# Altium project F103ZET6.PrjPCB
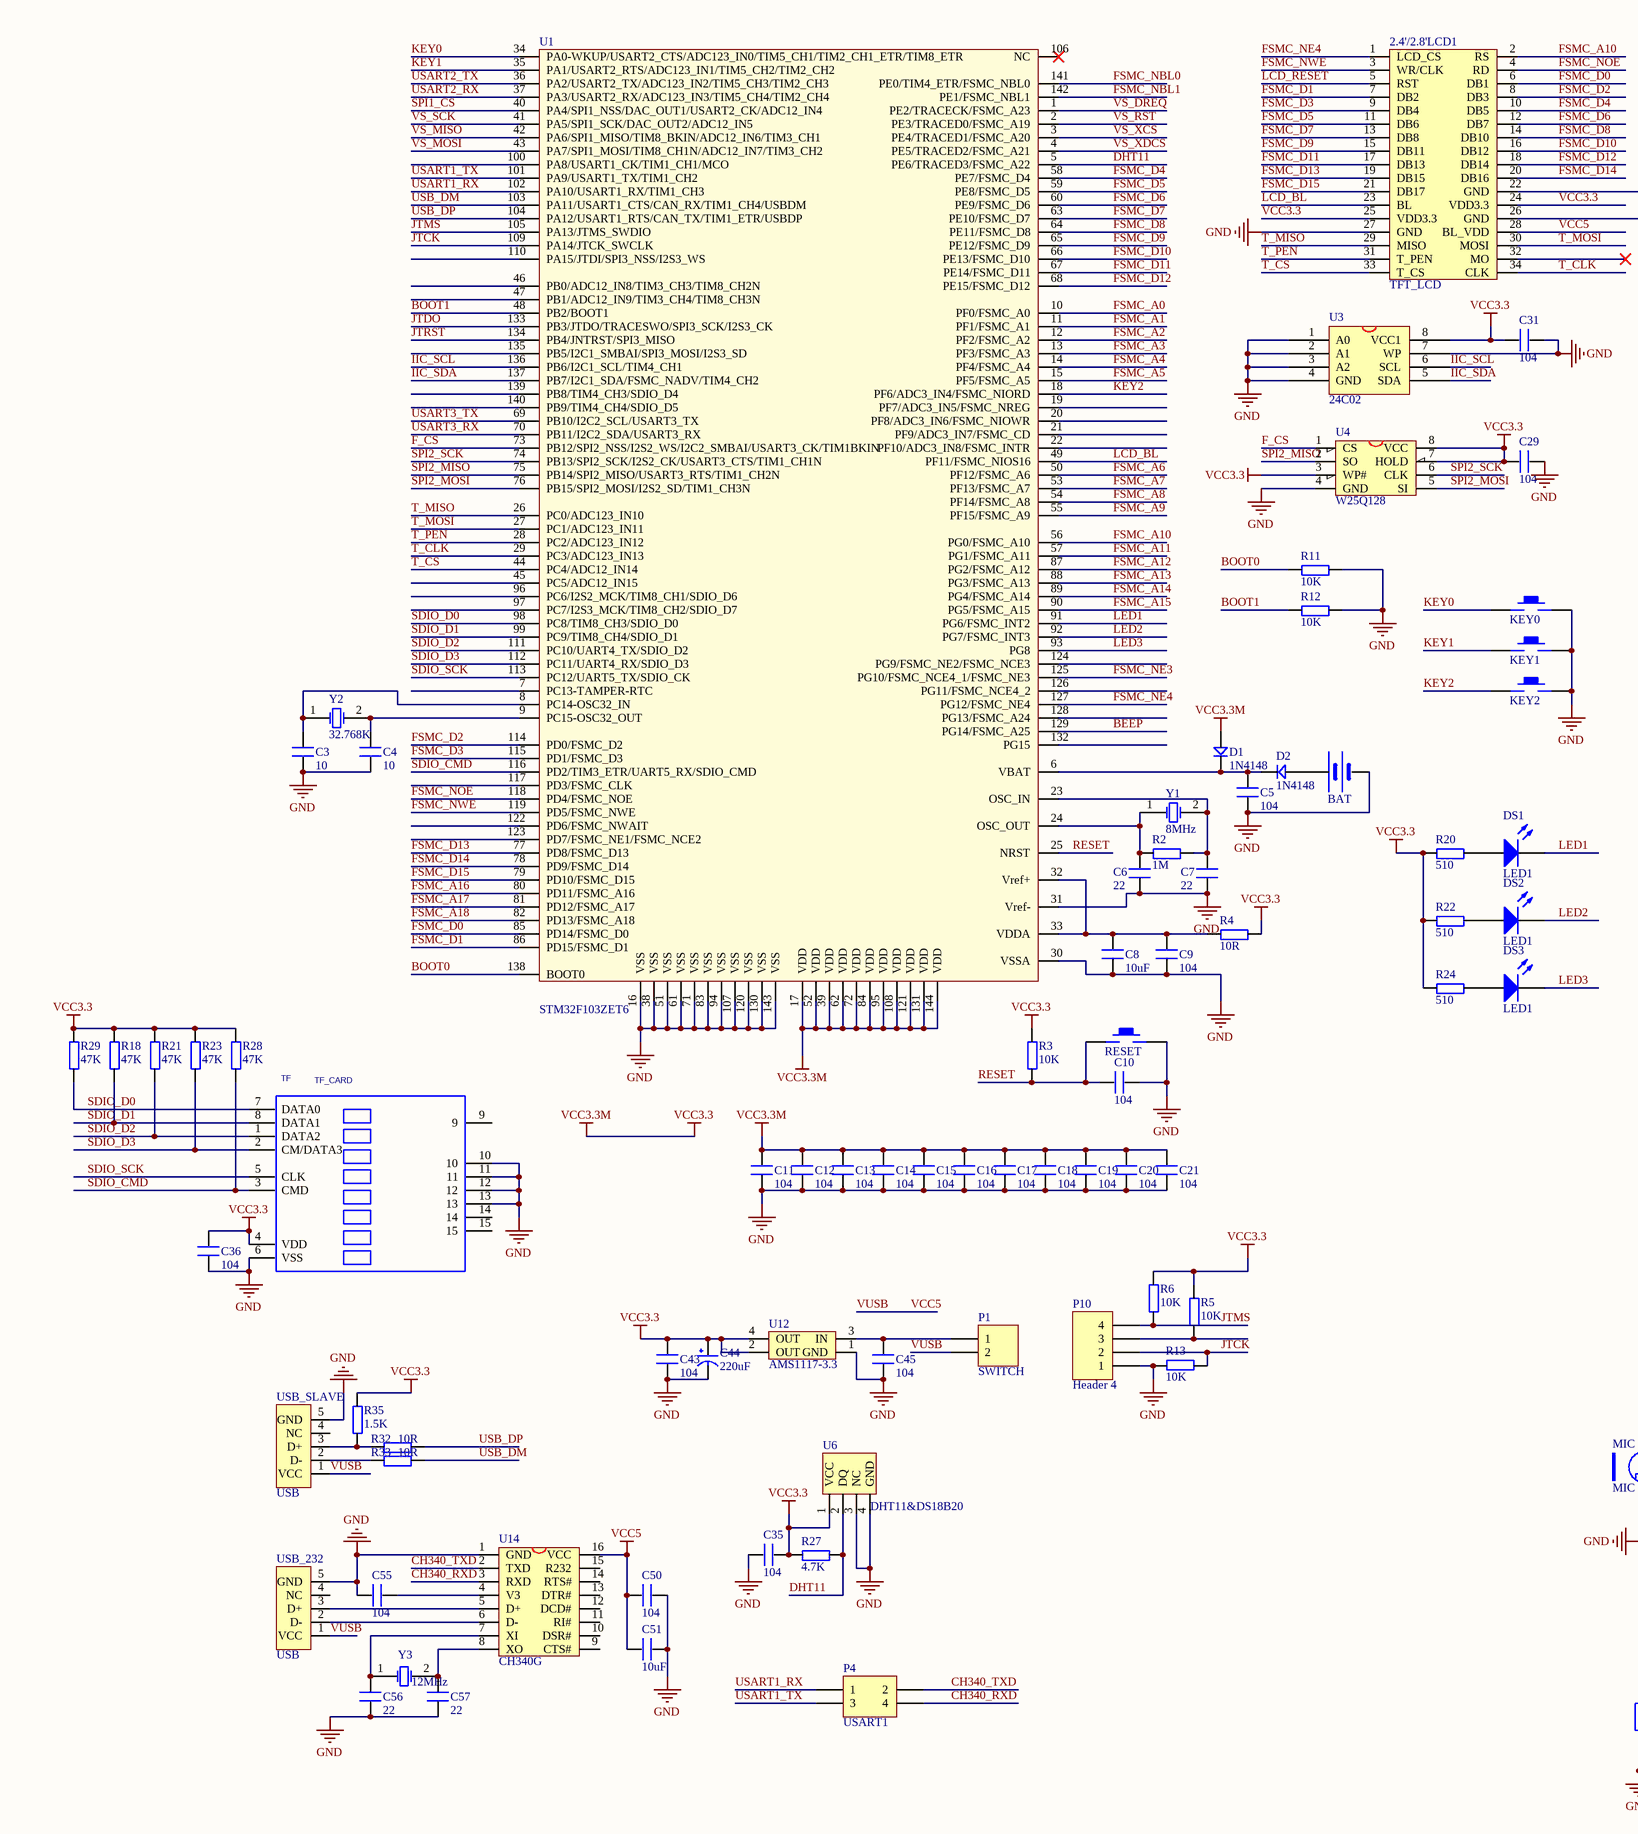
[diagram p0: F103ZET6.SchDoc, left]
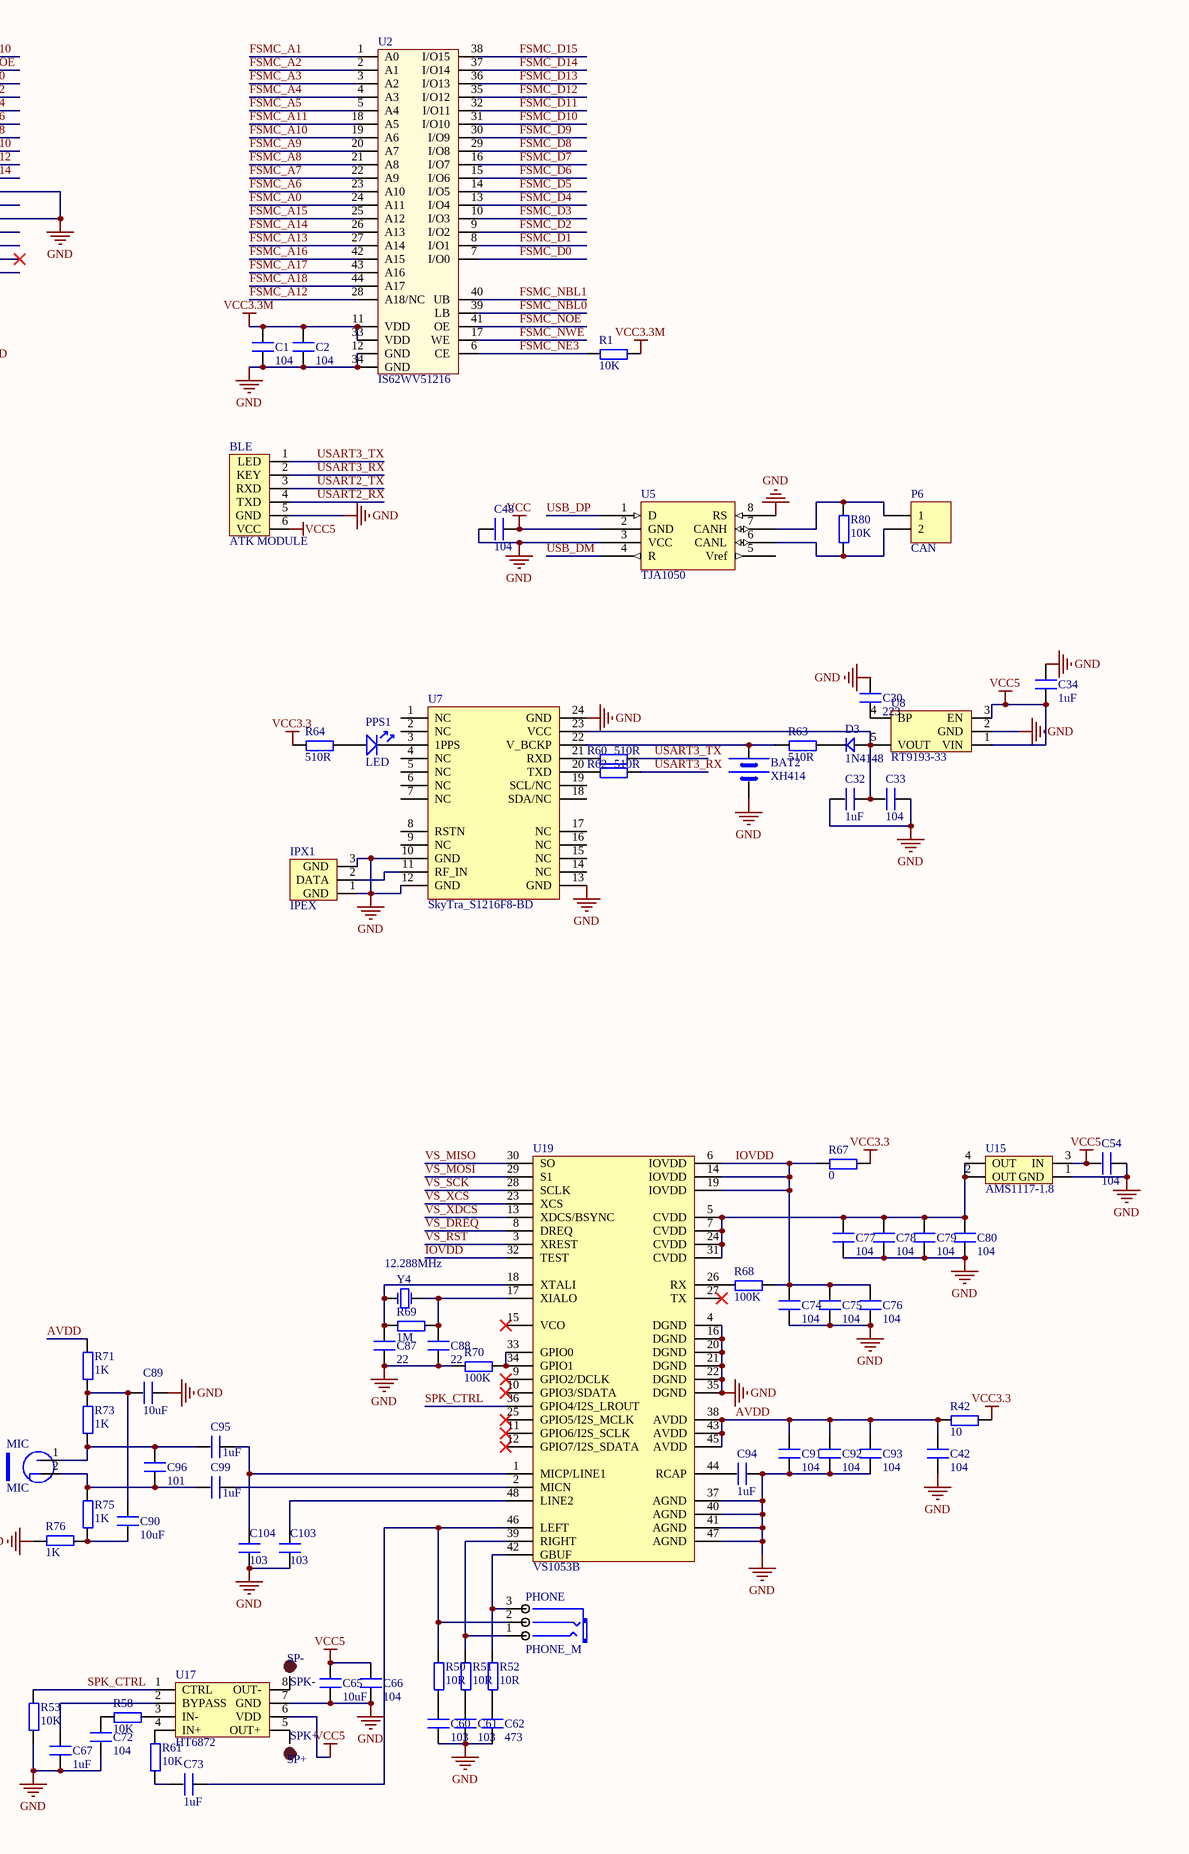
[diagram p1: F103ZET6.SchDoc, right]
1 sheet, 153 parts. Net scope: global (net labels, ports and power ports of the same name join across sheets).
Board file: F103ZET6.PcbDoc

## Sheet F103ZET6.SchDoc
size A2

### Parts
2.4'/2.8'LCD1  TFT_LCD  [db2*17-4.3]
BAT  BATT  [CR1220_A]  (value not drawn)
BAT2  XH414  [XH414]
BLE  ATK MODULE  [HEAD6]
C1  104  [C 0603_M]
C2  104  [C 0603_M]
C3  10  [C 0603_M]
C4  10  [C 0603_M]
C5  104  [C 0603_M]
C6  22  [C 0603_M]
C7  22  [C 0603_M]
C8  10uF  [C 0805_M]
C9  104  [C 0603_M]
C10  104  [C 0603_M]
C11  104  [C 0603_M]
C12  104  [C 0603_M]
C13  104  [C 0603_M]
C14  104  [C 0603_M]
C15  104  [C 0603_M]
C16  104  [C 0603_M]
C17  104  [C 0603_M]
C18  104  [C 0603_M]
C19  104  [C 0603_M]
C20  104  [C 0603_M]
C21  104  [C 0603_M]
C29  104  [C 0603_M]
C30  223  [0603P]
C31  104  [C 0603_M]
C32  1uF  [0603P]
C33  104  [0603P]
C34  1uF  [0603P]
C35  104  [C 0603_M]
C36  104  [C 0603_M]
C42  104  [C 0603_M]
C43  104  [C 0603_M]
C44  220uF  [CT 6*6 - C]
C45  104  [C 0603_M]
C48  104  [0603P]
C50  104  [C 0603_M]
C51  10uF  [C 0805_M]
C54  104  [C 0603_M]
C55  104  [C 0603_M]
C56  22  [C 0603_M]
C57  22  [C 0603_M]
C60  103  [C 0603_M]
C61  103  [C 0603_M]
C62  473  [C 0603_M]
C65  10uF  [C 0805_M]
C66  104  [C 0603_M]
C67  1uF  [C 0603_M]
C72  104  [C 0603_M]
C73  1uF  [C 0603_M]
C74  104  [C 0603_M]
C75  104  [C 0603_M]
C76  104  [C 0603_M]
C77  104  [C 0603_M]
C78  104  [C 0603_M]
C79  104  [C 0603_M]
C80  104  [C 0603_M]
C87  22  [C 0603_M]
C88  22  [C 0603_M]
C89  10uF  [C 0805_M]
C90  10uF  [C 0805_M]
C91  104  [C 0603_M]
C92  104  [C 0603_M]
C93  104  [C 0603_M]
C94  1uF  [C 0603_M]
C95  1uF  [C 0603_M]
C96  101  [C 0603_M]
C99  1uF  [C 0603_M]
C103  103  [C 0603_M]
C104  103  [C 0603_M]
D1  1N4148  [DIODE_SOP]
D2  1N4148  [DIODE_SOP]
D3  1N4148  [DIODE_SOP]
DS1  LED1  [LED 0603R]
DS2  LED1  [LED 0603R]
DS3  LED1  [LED 0603R]
IPX1  IPEX  [IPEX]
KEY0  KEY_M  [TSW SMD-3*6*2.5]  (value not drawn)
KEY1  KEY_M  [TSW SMD-3*6*2.5]  (value not drawn)
KEY2  KEY_M  [TSW SMD-3*6*2.5]  (value not drawn)
MIC  MIC  [MIC]
P1  SWITCH  [HDR2.54-LI-2P]
P4  USART1  [HDR2.54-LI-2x2P]
P6  CAN  [HDR1X2]
P10  Header 4  [HDR2.54-LI-4P]
PHONE  PHONE_M  [PHONE_ST]
PPS1  LED  [SMDLED]
R1  10K  [R 0603_M]
R2  1M  [R 0603_M]
R3  10K  [R 0603_M]
R4  10R  [R 0603_M]
R5  10K  [R 0603_M]
R6  10K  [R 0603_M]
R11  10K  [R 0603_M]
R12  10K  [R 0603_M]
R13  10K  [R 0603_M]
R18  47K  [R 0603_M]
R20  510  [0603P]
R21  47K  [R 0603_M]
R22  510  [0603P]
R23  47K  [R 0603_M]
R24  510  [0603P]
R27  4.7K  [R 0603_M]
R28  47K  [R 0603_M]
R29  47K  [R 0603_M]
R32  10R  [R 0603_M]
R33  10R  [R 0603_M]
R35  1.5K  [R 0603_M]
R42  10  [R 0603_M]
R50  10R  [R 0603_M]
R51  10R  [R 0603_M]
R52  10R  [R 0603_M]
R53  10K  [R 0603_M]
R58  10K  [R 0603_M]
R60  510R  [0603P]
R61  10K  [R 0603_M]
R62  510R  [0603P]
R63  510R  [0603P]
R64  510R  [0603P]
R67  0  [R 0603_M]
R68  100K  [R 0603_M]
R69  1M  [R 0603_M]
R70  100K  [R 0603_M]
R71  1K  [R 0603_M]
R73  1K  [R 0603_M]
R75  1K  [R 0603_M]
R76  1K  [R 0603_M]
R80  10K  [0603P]
RESET  KEY_M  [TSW SMD-3*6*2.5]  (value not drawn)
SP+  SPK+  [TP-1.5]
SP-  SPK-  [TP-1.5]
TF  TF_CARD  [TF_CARD]
U1  STM32F103ZET6  [LQFP144]
U2  IS62WV51216  [TSOP44]
U3  24C02  [SOP-8]
U4  W25Q128  [SOIC-8]
U5  TJA1050  [SOP-8]
U6  DHT11&DS18B20  [DHT11]
U7  SkyTra_S1216F8-BD  [GPS_NEO-6]
U8  RT9193-33  [SOT-23-5]
U12  AMS1117-3.3  [AMS1117]
U14  CH340G  [SOP16M]
U15  AMS1117-1.8  [AMS1117]
U17  HT6872  [SOP-8]
U19  VS1053B  [mTQFP48]
USB_232  USB  [USB-MINI-A]
USB_SLAVE  USB  [USB-MINI-A]
Y1  8MHz  [OSC HC-49S]
Y2  32.768K  [OSC-2x6-WI-A]
Y3  12MHz  [OSC HC-49S]
Y4  12.288MHz  [OSC HC-49S]

### Nets
GND: 2.4'/2.8'LCD1.22(GND) 2.4'/2.8'LCD1.26(GND) 2.4'/2.8'LCD1.27(GND) BAT.2(GND) BAT2.2(GND) BLE.5(GND) C1.1 C2.1 C3.1 C4.2 C5.1 C6.1 C7.1 C8.1 C9.1 C10.1 C11.1 C12.1 C13.1 C14.1 C15.1 C16.1 C17.1 C18.1 C19.1 C20.1 C21.1 C29.2 C30.2 C31.2 C32.1 C33.2 C34.2 C35.1 C36.1 C42.1 C43.1 C44.2(GND) C45.1 C48.1 C50.2 C51.2 C54.2 C55.1 C56.1 C57.2 C60.1 C61.1 C62.1 C65.1 C66.1 C67.1 C72.1 C74.1 C75.1 C76.1 C77.2 C78.2 C79.2 C80.1 C87.1 C88.1 C89.1 C91.1 C92.1 C93.1 C94.2 C103.1 C104.1 IPX1.1(GND) IPX1.3(GND) KEY0.2 KEY1.2 KEY2.2 P10.1 R11.2 R12.2 R13.2 R53.1 R70.1 R76.2 RESET.2 TF.6(VSS) TF.10 TF.11 TF.12 TF.13 U1.16(VSS) U1.30(VSSA) U1.31(Vref-) U1.38(VSS) U1.51(VSS) U1.61(VSS) U1.71(VSS) U1.83(VSS) U1.94(VSS) U1.107(VSS) U1.120(VSS) U1.130(VSS) U1.143(VSS) U2.12(GND) U2.34(GND) U3.1(A0) U3.2(A1) U3.3(A2) U3.4(GND) U3.7(WP) U4.4(GND) U5.3(VCC) U5.8(RS) U6.3(NC) U6.4(GND) U7.10(GND) U7.12(GND) U7.13(GND) U7.24(GND) U8.2(GND) U12.1(GND) U14.1(GND) U15.1(GND) U17.7(GND) U19.4(DGND) U19.16(DGND) U19.20(DGND) U19.21(DGND) U19.22(DGND) U19.35(DGND) U19.37(AGND) U19.40(AGND) U19.41(AGND) U19.47(AGND) USB_232.5(GND) USB_SLAVE.5(GND)
VCC: C48.2 U5.2(GND)
VCC3.3: 2.4'/2.8'LCD1.24(VDD3.3) 2.4'/2.8'LCD1.25(VDD3.3) C1.2 C2.2 C11.2 C12.2 C13.2 C14.2 C15.2 C16.2 C17.2 C18.2 C19.2 C20.2 C21.2 C29.1 C31.1 C35.2 C36.2 C43.2 C44.1(VCC) D1.1 R1.2 R3.2 R4.2 R5.2 R6.2 R18.2 R20.1 R21.2 R22.1 R23.2 R24.1 R27.1 R28.2 R29.2 R35.2 R42.2 R64.1 R67.2 TF.4(VDD) U1.17(VDD) U1.39(VDD) U1.52(VDD) U1.62(VDD) U1.72(VDD) U1.84(VDD) U1.95(VDD) U1.108(VDD) U1.121(VDD) U1.131(VDD) U1.144(VDD) U2.11(VDD) U2.33(VDD) U3.8(VCC1) U4.3(WP#) U4.7(HOLD) U4.8(VCC) U6.1(VCC) U12.2(OUT) U12.4(OUT)  [also labelled VCC3.3M]
VCC5: 2.4'/2.8'LCD1.28(BL_VDD) BLE.6(VCC) C34.1 C50.1 C51.1 C54.1 C65.2 C66.2 P1.2 U8.1(VIN) U8.3(EN) U14.16(VCC) U15.3(IN) U17.6(VDD) USB_232.1(VCC) USB_SLAVE.1(VCC)  [also labelled VUSB]
AVDD: C42.2 C91.2 C92.2 C93.2 R42.1 R71.2 U19.38(AVDD) U19.43(AVDD) U19.45(AVDD)
BEEP: U1.129(PG14/FSMC_A25)
BOOT0: R11.1 U1.138(BOOT0)
BOOT1: R12.1 U1.48(PB2/BOOT1)
CH340_RXD: P4.4 U14.3(RXD)
CH340_TXD: P4.2 U14.2(TXD)
DHT11: R27.2 U1.5(PE6/TRACED3/FSMC_A22) U6.2(DQ)
F_CS: U1.73(PB12/SPI2_NSS/I2S2_WS/I2C2_SMBAI/USART3_CK/TIM1BKIN) U4.1(CS)
FSMC_A0: U1.10(PF0/FSMC_A0) U2.24(A11)
FSMC_A1: U1.11(PF1/FSMC_A1) U2.1(A0)
FSMC_A2: U1.12(PF2/FSMC_A2) U2.2(A1)
FSMC_A3: U1.13(PF3/FSMC_A3) U2.3(A2)
FSMC_A4: U1.14(PF4/FSMC_A4) U2.4(A3)
FSMC_A5: U1.15(PF5/FSMC_A5) U2.5(A4)
FSMC_A6: U1.50(PF12/FSMC_A6) U2.23(A10)
FSMC_A7: U1.53(PF13/FSMC_A7) U2.22(A9)
FSMC_A8: U1.54(PF14/FSMC_A8) U2.21(A8)
FSMC_A9: U1.55(PF15/FSMC_A9) U2.20(A7)
FSMC_A10: 2.4'/2.8'LCD1.2(RS) U1.56(PG0/FSMC_A10) U2.19(A6)
FSMC_A11: U1.57(PG1/FSMC_A11) U2.18(A5)
FSMC_A12: U1.87(PG2/FSMC_A12) U2.28(A18/NC)
FSMC_A13: U1.88(PG3/FSMC_A13) U2.27(A14)
FSMC_A14: U1.89(PG4/FSMC_A14) U2.26(A13)
FSMC_A15: U1.90(PG5/FSMC_A15) U2.25(A12)
FSMC_A16: U1.80(PD11/FSMC_A16) U2.42(A15)
FSMC_A17: U1.81(PD12/FSMC_A17) U2.43(A16)
FSMC_A18: U1.82(PD13/FSMC_A18) U2.44(A17)
FSMC_D0: 2.4'/2.8'LCD1.6(DB1) U1.85(PD14/FSMC_D0) U2.7(I/O0)
FSMC_D1: 2.4'/2.8'LCD1.7(DB2) U1.86(PD15/FSMC_D1) U2.8(I/O1)
FSMC_D2: 2.4'/2.8'LCD1.8(DB3) U1.114(PD0/FSMC_D2) U2.9(I/O2)
FSMC_D3: 2.4'/2.8'LCD1.9(DB4) U1.115(PD1/FSMC_D3) U2.10(I/O3)
FSMC_D4: 2.4'/2.8'LCD1.10(DB5) U1.58(PE7/FSMC_D4) U2.13(I/O4)
FSMC_D5: 2.4'/2.8'LCD1.11(DB6) U1.59(PE8/FSMC_D5) U2.14(I/O5)
FSMC_D6: 2.4'/2.8'LCD1.12(DB7) U1.60(PE9/FSMC_D6) U2.15(I/O6)
FSMC_D7: 2.4'/2.8'LCD1.13(DB8) U1.63(PE10/FSMC_D7) U2.16(I/O7)
FSMC_D8: 2.4'/2.8'LCD1.14(DB10) U1.64(PE11/FSMC_D8) U2.29(I/O8)
FSMC_D9: 2.4'/2.8'LCD1.15(DB11) U1.65(PE12/FSMC_D9) U2.30(I/O9)
FSMC_D10: 2.4'/2.8'LCD1.16(DB12) U1.66(PE13/FSMC_D10) U2.31(I/O10)
FSMC_D11: 2.4'/2.8'LCD1.17(DB13) U1.67(PE14/FSMC_D11) U2.32(I/O11)
FSMC_D12: 2.4'/2.8'LCD1.18(DB14) U1.68(PE15/FSMC_D12) U2.35(I/O12)
FSMC_D13: 2.4'/2.8'LCD1.19(DB15) U1.77(PD8/FSMC_D13) U2.36(I/O13)
FSMC_D14: 2.4'/2.8'LCD1.20(DB16) U1.78(PD9/FSMC_D14) U2.37(I/O14)
FSMC_D15: 2.4'/2.8'LCD1.21(DB17) U1.79(PD10/FSMC_D15) U2.38(I/O15)
FSMC_NBL0: U1.141(PE0/TIM4_ETR/FSMC_NBL0) U2.39(LB)
FSMC_NBL1: U1.142(PE1/FSMC_NBL1) U2.40(UB)
FSMC_NE3: R1.1 U1.125(PG10/FSMC_NCE4_1/FSMC_NE3) U2.6(CE)
FSMC_NE4: 2.4'/2.8'LCD1.1(LCD_CS) U1.127(PG12/FSMC_NE4)
FSMC_NOE: 2.4'/2.8'LCD1.4(RD) U1.118(PD4/FSMC_NOE) U2.41(OE)
FSMC_NWE: 2.4'/2.8'LCD1.3(WR/CLK) U1.119(PD5/FSMC_NWE) U2.17(WE)
IIC_SCL: U1.136(PB6/I2C1_SCL/TIM4_CH1) U3.6(SCL)
IIC_SDA: U1.137(PB7/I2C1_SDA/FSMC_NADV/TIM4_CH2) U3.5(SDA)
IOVDD: C74.2 C75.2 C76.2 R67.1 R68.2 U19.6(IOVDD) U19.14(IOVDD) U19.19(IOVDD) U19.32(TEST)
JTCK: P10.2 R13.1 U1.109(PA14/JTCK_SWCLK)
JTDO: U1.133(PB3/JTDO/TRACESWO/SPI3_SCK/I2S3_CK)
JTMS: P10.4 R6.1 U1.105(PA13/JTMS_SWDIO)
JTRST: U1.134(PB4/JNTRST/SPI3_MISO)
KEY0: KEY0.1 U1.34(PA0-WKUP/USART2_CTS/ADC123_IN0/TIM5_CH1/TIM2_CH1_ETR/TIM8_ETR)
KEY1: KEY1.1 U1.35(PA1/USART2_RTS/ADC123_IN1/TIM5_CH2/TIM2_CH2)
KEY2: KEY2.1 U1.18(PF6/ADC3_IN4/FSMC_NIORD)
LCD_BL: 2.4'/2.8'LCD1.23(BL) U1.49(PF11/FSMC_NIOS16)
LCD_RESET: 2.4'/2.8'LCD1.5(RST)
LED1: DS1.2(K) U1.91(PG6/FSMC_INT2)
LED2: DS2.2(K) U1.92(PG7/FSMC_INT3)
LED3: DS3.2(K) U1.93(PG8)
RESET: C10.2 R3.1 RESET.1 U1.25(NRST)
SDIO_CMD: R28.1 TF.3(CMD) U1.116(PD2/TIM3_ETR/UART5_RX/SDIO_CMD)
SDIO_D0: R29.1 TF.7(DATA0) U1.98(PC8/TIM8_CH3/SDIO_D0)
SDIO_D1: R18.1 TF.8(DATA1) U1.99(PC9/TIM8_CH4/SDIO_D1)
SDIO_D2: R21.1 TF.1(DATA2) U1.111(PC10/UART4_TX/SDIO_D2)
SDIO_D3: R23.1 TF.2(CM/DATA3) U1.112(PC11/UART4_RX/SDIO_D3)
SDIO_SCK: TF.5(CLK) U1.113(PC12/UART5_TX/SDIO_CK)
SPI1_CS: U1.40(PA4/SPI1_NSS/DAC_OUT1/USART2_CK/ADC12_IN4)
SPI2_MISO: U1.75(PB14/SPI2_MISO/USART3_RTS/TIM1_CH2N) U4.2(SO)
SPI2_MOSI: U1.76(PB15/SPI2_MOSI/I2S2_SD/TIM1_CH3N) U4.5(SI)
SPI2_SCK: U1.74(PB13/SPI2_SCK/I2S2_CK/USART3_CTS/TIM1_CH1N) U4.6(CLK)
SPK_CTRL: R53.2 U17.1(CTRL) U19.36(GPIO4/I2S_LROUT)
T_CLK: 2.4'/2.8'LCD1.34(CLK) U1.29(PC3/ADC123_IN13)
T_CS: 2.4'/2.8'LCD1.33(T_CS) U1.44(PC4/ADC12_IN14)
T_MISO: 2.4'/2.8'LCD1.29(MISO) U1.26(PC0/ADC123_IN10)
T_MOSI: 2.4'/2.8'LCD1.30(MOSI) U1.27(PC1/ADC123_IN11)
T_PEN: 2.4'/2.8'LCD1.31(T_PEN) U1.28(PC2/ADC123_IN12)
USART1_RX: P4.1 U1.102(PA10/USART1_RX/TIM1_CH3)
USART1_TX: P4.3 U1.101(PA9/USART1_TX/TIM1_CH2)
USART2_RX: BLE.4(TXD) U1.37(PA3/USART2_RX/ADC123_IN3/TIM5_CH4/TIM2_CH4)
USART2_TX: BLE.3(RXD) U1.36(PA2/USART2_TX/ADC123_IN2/TIM5_CH3/TIM2_CH3)
USART3_RX: BLE.2(KEY) R62.2 U1.70(PB11/I2C2_SDA/USART3_RX)
USART3_TX: BLE.1(LED) R60.2 U1.69(PB10/I2C2_SCL/USART3_TX)
USB_DM: R33.2 U1.103(PA11/USART1_CTS/CAN_RX/TIM1_CH4/USBDM) U5.4(R)
USB_DP: R32.2 U1.104(PA12/USART1_RTS/CAN_TX/TIM1_ETR/USBDP) U5.1(D)
VS_DREQ: U1.1(PE2/TRACECK/FSMC_A23) U19.8(DREQ)
VS_MISO: U1.42(PA6/SPI1_MISO/TIM8_BKIN/ADC12_IN6/TIM3_CH1) U19.30(SO)
VS_MOSI: U1.43(PA7/SPI1_MOSI/TIM8_CH1N/ADC12_IN7/TIM3_CH2) U19.29(S1)
VS_RST: U1.2(PE3/TRACED0/FSMC_A19) U19.3(XREST)
VS_SCK: U1.41(PA5/SPI1_SCK/DAC_OUT2/ADC12_IN5) U19.28(SCLK)
VS_XCS: U1.3(PE4/TRACED1/FSMC_A20) U19.23(XCS)
VS_XDCS: U1.4(PE5/TRACED2/FSMC_A21) U19.13(XDCS/BSYNC)
NetBAT2_1: BAT2.1(VCC) R63.1 U7.22(V_BCKP)
NetBAT_1: BAT.1(VCC) D2.1
NetC3_2: C3.2 U1.8(PC14-OSC32_IN) Y2.1(OSC1)
NetC4_1: C4.1 U1.9(PC15-OSC32_OUT) Y2.2(OSC2)
NetC5_2: C5.2 D1.2 D2.2 U1.6(VBAT)
NetC6_2: C6.2 R2.1 U1.24(OSC_OUT) Y1.1(OSC1)
NetC7_2: C7.2 R2.2 U1.23(OSC_IN) Y1.2(OSC2)
NetC8_2: C8.2 C9.2 R4.1 U1.32(Vref+) U1.33(VDDA)
NetC30_1: C30.1 U8.4(BP)
NetC32_2: C32.2 C33.1 D3.1 U7.23(VCC) U8.5(VOUT)
NetC45_2: C45.2 P1.1 U12.3(IN)
NetC55_2: C55.2 U14.4(V3)
NetC56_2: C56.2 U14.7(XI) Y3.1(OSC1)
NetC57_1: C57.1 U14.8(XO) Y3.2(OSC2)
NetC60_2: C60.2 R50.1
NetC61_2: C61.2 R51.1
NetC62_2: C62.2 R52.1
NetC67_2: C67.2 U17.2(BYPASS)
NetC72_2: C72.2 R58.1
NetC73_1: C73.1 PHONE.2(CHR) R50.2 U19.46(LEFT)
NetC73_2: C73.2 R61.1
NetC77_1: C77.1 C78.1 C79.1 C80.2 U15.2(OUT) U15.4(OUT) U19.5(CVDD) U19.7(CVDD) U19.24(CVDD) U19.31(CVDD)
NetC87_2: C87.2 R69.1 U19.18(XTALI) Y4.1(OSC1)
NetC88_2: C88.2 R69.2 U19.17(XIALO) Y4.2(OSC2)
NetC89_2: C89.2 C90.2 R71.1 R73.2
NetC90_1: C90.1 R75.1 R76.1
NetC94_1: C94.1 U19.44(RCAP)
NetC95_1: C95.1 C96.2 MIC.1(VCC) R73.1
NetC95_2: C95.2 C104.2 U19.1(MICP/LINE1)
NetC96_1: C96.1 C99.2 MIC.2(GND) R75.2
NetC99_1: C99.1 U19.2(MICN)
NetC103_2: C103.2 U19.48(LINE2)
NetD3_2: D3.2 R63.2
NetDS1_1: DS1.1(A) R20.2
NetDS2_1: DS2.1(A) R22.2
NetDS3_1: DS3.1(A) R24.2
NetIPX1_2: IPX1.2(DATA) U7.11(RF_IN)
NetP6_1: P6.1 R80.2 U5.7(CANH)
NetP6_2: P6.2 R80.1 U5.6(CANL)
NetP10_3: P10.3 R5.1
NetPHONE_1: PHONE.1(CHL) R51.2 U19.39(RIGHT)
NetPHONE_3: PHONE.3(COM) R52.2 U19.42(GBUF)
NetPPS1_1: PPS1.1 R64.2
NetPPS1_2: PPS1.2 U7.3(1PPS)
NetR32_1: R32.1 R35.1 USB_SLAVE.3(D+)
NetR33_1: R33.1 USB_SLAVE.2(D-)
NetR58_2: R58.2 U17.3(IN-)
NetR60_1: R60.1 U7.21(RXD)
NetR61_2: R61.2 U17.4(IN+)
NetR62_1: R62.1 U7.20(TXD)
NetR68_1: R68.1 U19.26(RX)
NetR70_2: R70.2 U19.33(GPIO0) U19.34(GPIO1)
NetSP+_1: SP+.1 U17.5(OUT+)
NetSP-_1: SP-.1 U17.8(OUT-)
NetU14_5: U14.5(D+) USB_232.3(D+)
NetU14_6: U14.6(D-) USB_232.2(D-)

Not connected (* = marked no-connect by the designer): 2.4'/2.8'LCD1 32(MO)*; TF 9 14 15; U1 7(PC13-TAMPER-RTC) 19(PF7/ADC3_IN5/FSMC_NREG) 20(PF8/ADC3_IN6/FSMC_NIOWR) 21(PF9/ADC3_IN7/FSMC_CD) 22(PF10/ADC3_IN8/FSMC_INTR) 45(PC5/ADC12_IN15) 46(PB0/ADC12_IN8/TIM3_CH3/TIM8_CH2N) 47(PB1/ADC12_IN9/TIM3_CH4/TIM8_CH3N) 96(PC6/I2S2_MCK/TIM8_CH1/SDIO_D6) 97(PC7/I2S3_MCK/TIM8_CH2/SDIO_D7) 100(PA8/USART1_CK/TIM1_CH1/MCO) 106(NC)* 110(PA15/JTDI/SPI3_NSS/I2S3_WS) 117(PD3/FSMC_CLK) 122(PD6/FSMC_NWAIT) 123(PD7/FSMC_NE1/FSMC_NCE2) 124(PG9/FSMC_NE2/FSMC_NCE3) 126(PG11/FSMC_NCE4_2) 128(PG13/FSMC_A24) 132(PG15) 135(PB5/I2C1_SMBAI/SPI3_MOSI/I2S3_SD) 139(PB8/TIM4_CH3/SDIO_D4) 140(PB9/TIM4_CH4/SDIO_D5); U5 5(Vref); U7 1(NC) 2(NC) 4(NC) 5(NC) 6(NC) 7(NC) 8(RSTN) 9(NC) 14(NC) 15(NC) 16(NC) 17(NC) 18(SDA/NC) 19(SCL/NC); U14 9(CTS#) 10(DSR#) 11(RI#) 12(DCD#) 13(DTR#) 14(RTS#) 15(R232); U19 9(GPIO2/DCLK)* 10(GPIO3/SDATA)* 11(GPIO6/I2S_SCLK)* 12(GPIO7/I2S_SDATA)* 15(VCO)* 25(GPIO5/I2S_MCLK)* 27(TX)*; USB_232 4(NC); USB_SLAVE 4(NC)

### Library data of the parts
BAT = BAT
BAT2 = XH414: XH414 IV01E
BLE = ATK-HC05
C1-C21 C29-C36 C42 C43 C45 C48 C50 C51 C54-C57 C60-C62 C65-C67 C72-C80 C87-C96 C99 C103 C104 = C
C44 = CAP
D1-D3 = D
DS1-DS3 = LED2: Typical RED, GREEN, YELLOW, AMBER GaAs LED; Published: 8-Jun-2000; LatestRevisionDate: 17-Jul-2002; LatestRevisionNote: Re-released for DXP Platform.; PackageDocument: Feb-2002; PackageReference: 3.2X1.6X1.1; Publisher: Altium Limited
IPX1 = IPEX: IPEX座
P1 P6 = Header 2: Header, 2-Pin; LatestRevisionDate: 17-Jul-2002; LatestRevisionNote: Re-released for DXP Platform.; Publisher: Altium Limited
P4 = Header 2X2: Header, 2-Pin, Dual row; LatestRevisionDate: 17-Jul-2002; LatestRevisionNote: Re-released for DXP Platform.; Publisher: Altium Limited
P10 = Header 4: Header, 4-Pin; LatestRevisionDate: 17-Jul-2002; LatestRevisionNote: Re-released for DXP Platform.; Publisher: Altium Limited
R1-R6 R11-R13 R18 R20-R24 R27-R29 R32 R33 R35 R42 R50-R53 R58 R60-R64 R67-R71 R73 R75 R76 R80 = R
SP+ SP- = TEST-POINT: 测试点
TF = TF_CARD: Manufacturer #1 PN: MicroSD座/手机卡存储卡座; PCB DECAL: TF_CARD
U2 = IS61LV51216
U3 = 24C256
U4 = W25X16: W25X16;SST25VF016;MX25L1605
U5 = SN65HVD230D
U6 = DHT11: 数字温湿度传感器
U7 = SkyTra_GPS
U8 = RT9193-33: 3.3V超低压差LDO
U12 U15 = AMS1117
U14 = CH340G: USB2UART
U17 = HT6871
U19 = VS1053
USB_232 USB_SLAVE = USB5
Y1-Y4 = XTAL: Crystal Oscillator; Published: 8-Jun-2000; LatestRevisionDate: 17-Jul-2002; LatestRevisionNote: Re-released for DXP Platform.; Publisher: Altium Limited